# EasyEDA Pro project 内机V10_1.epro, schematic 内机底板_1, sheets 1 to 3 of 6

## Sheets
1 BLOCK: Board Name: 内机V10_1; Create Date: 2025-12-01
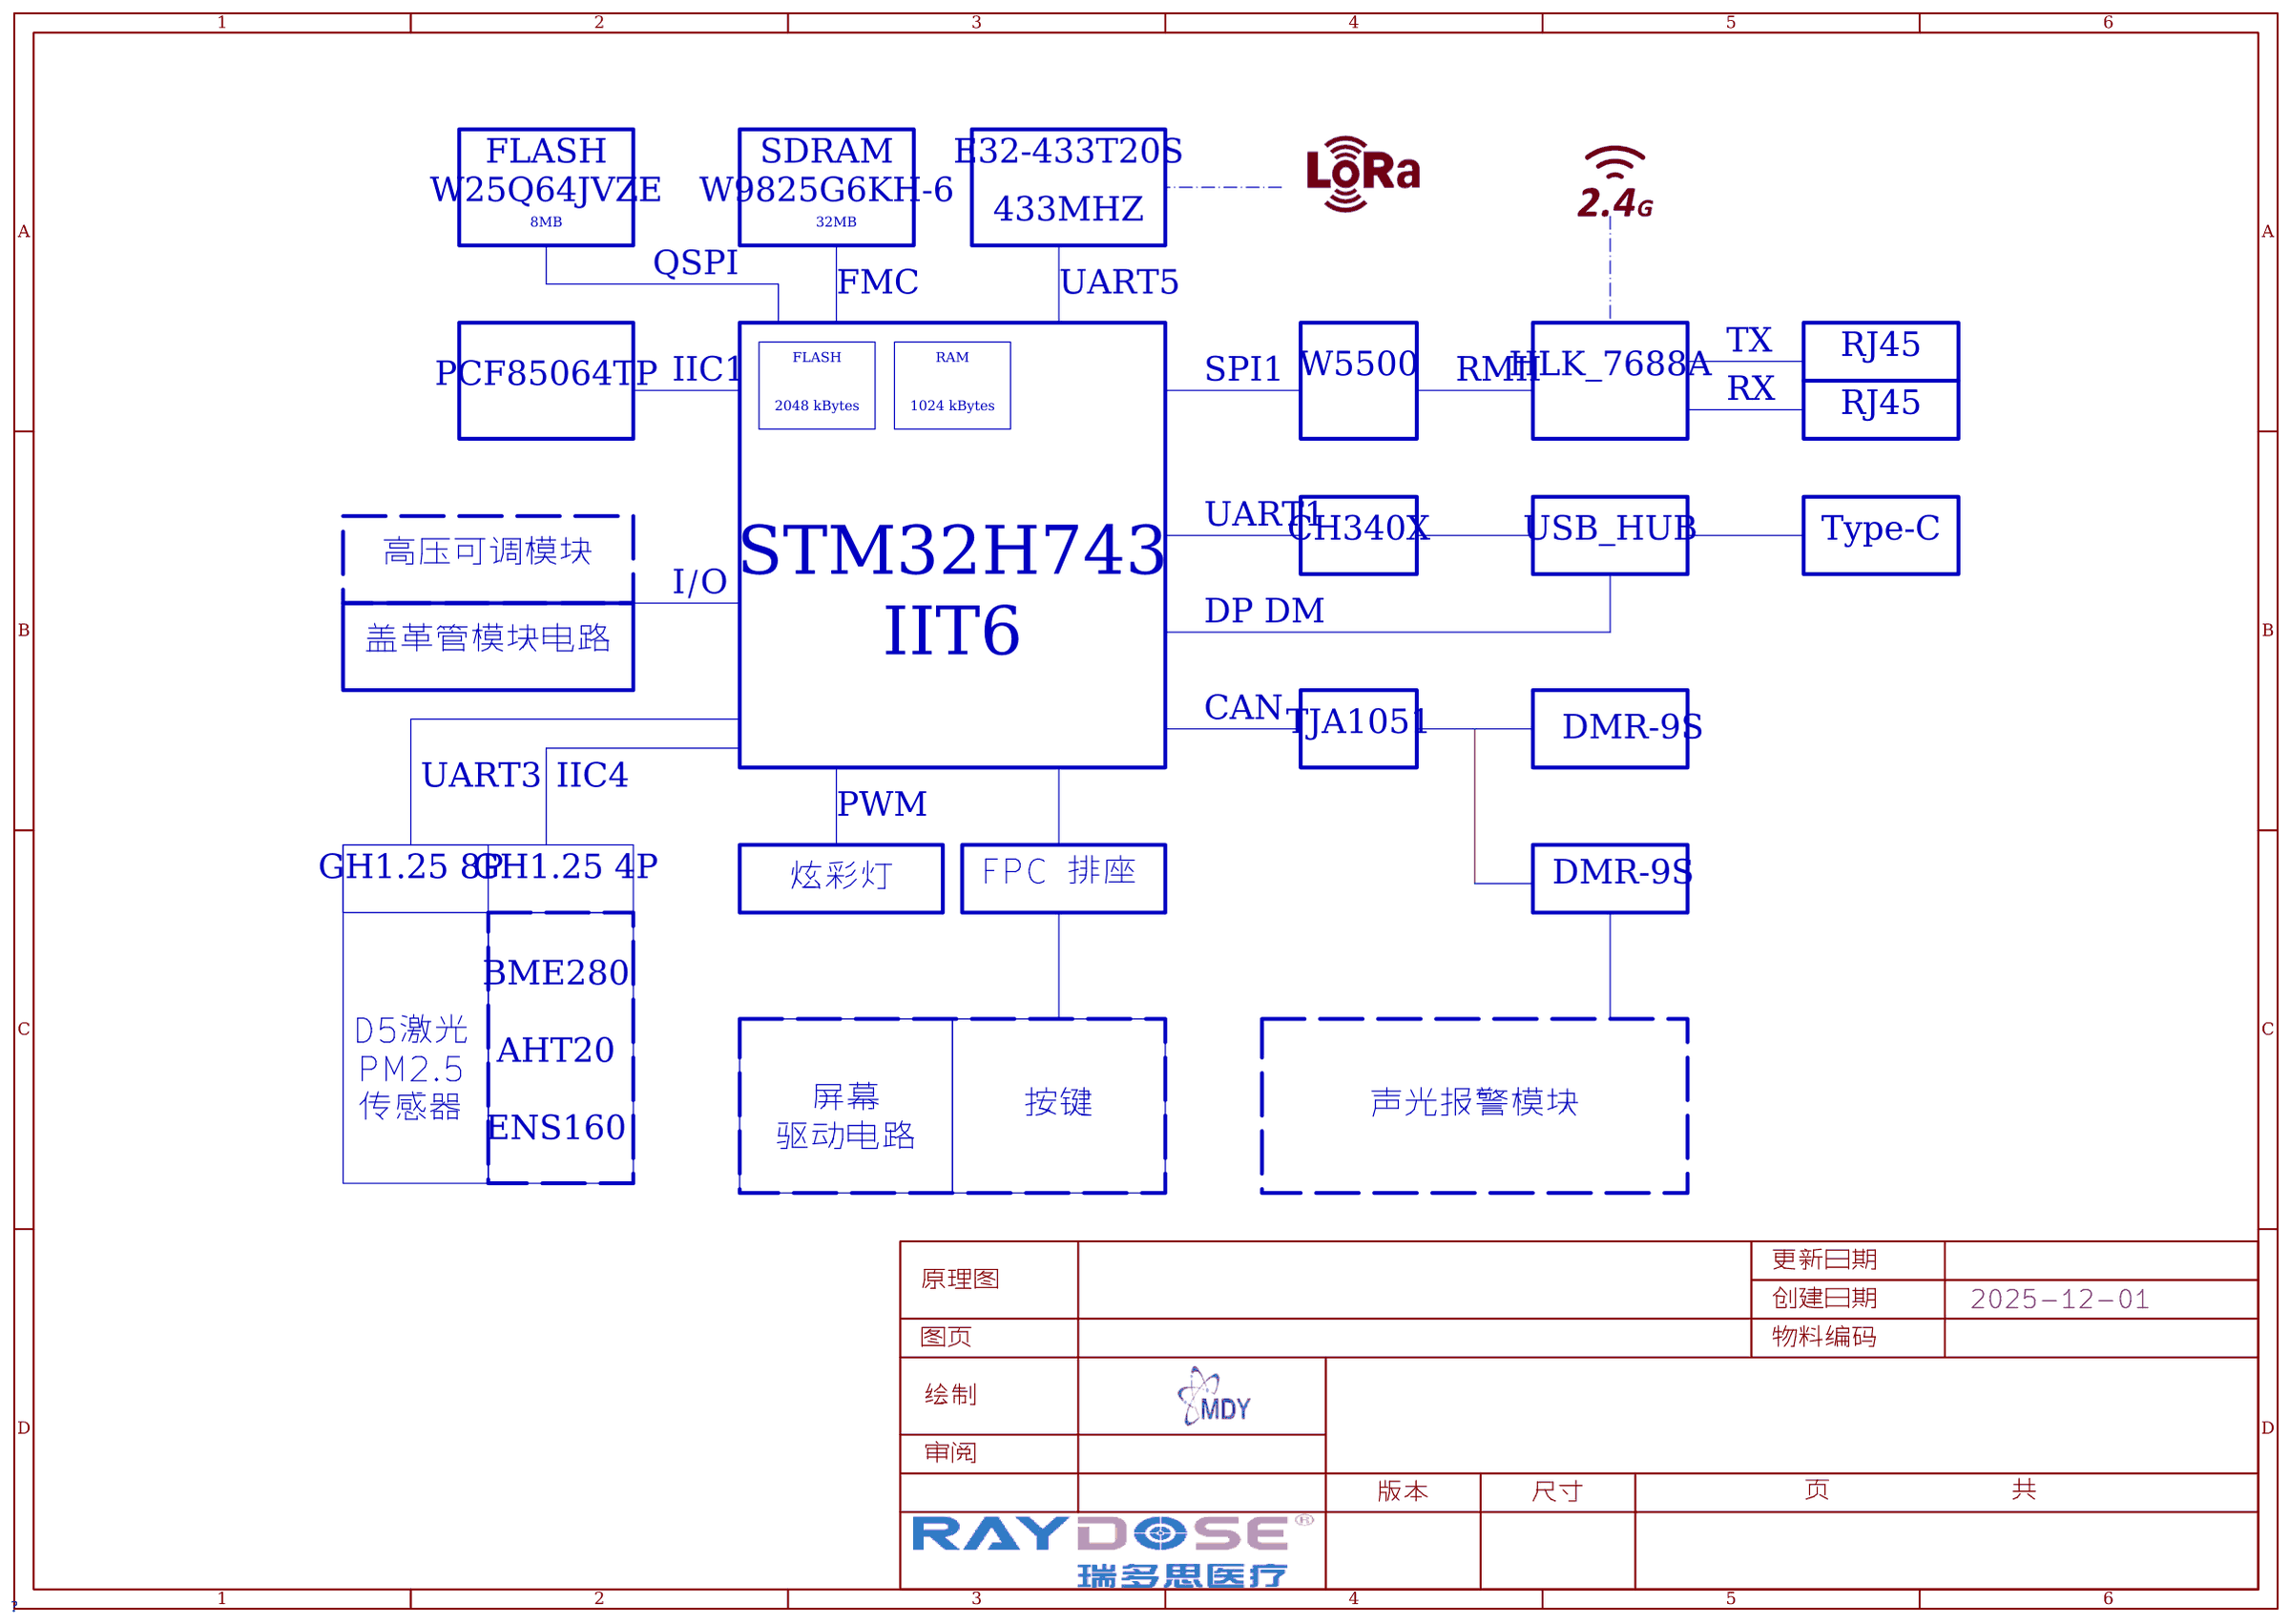
[diagram p0: BLOCK]
2 POWER: Page Size: A4
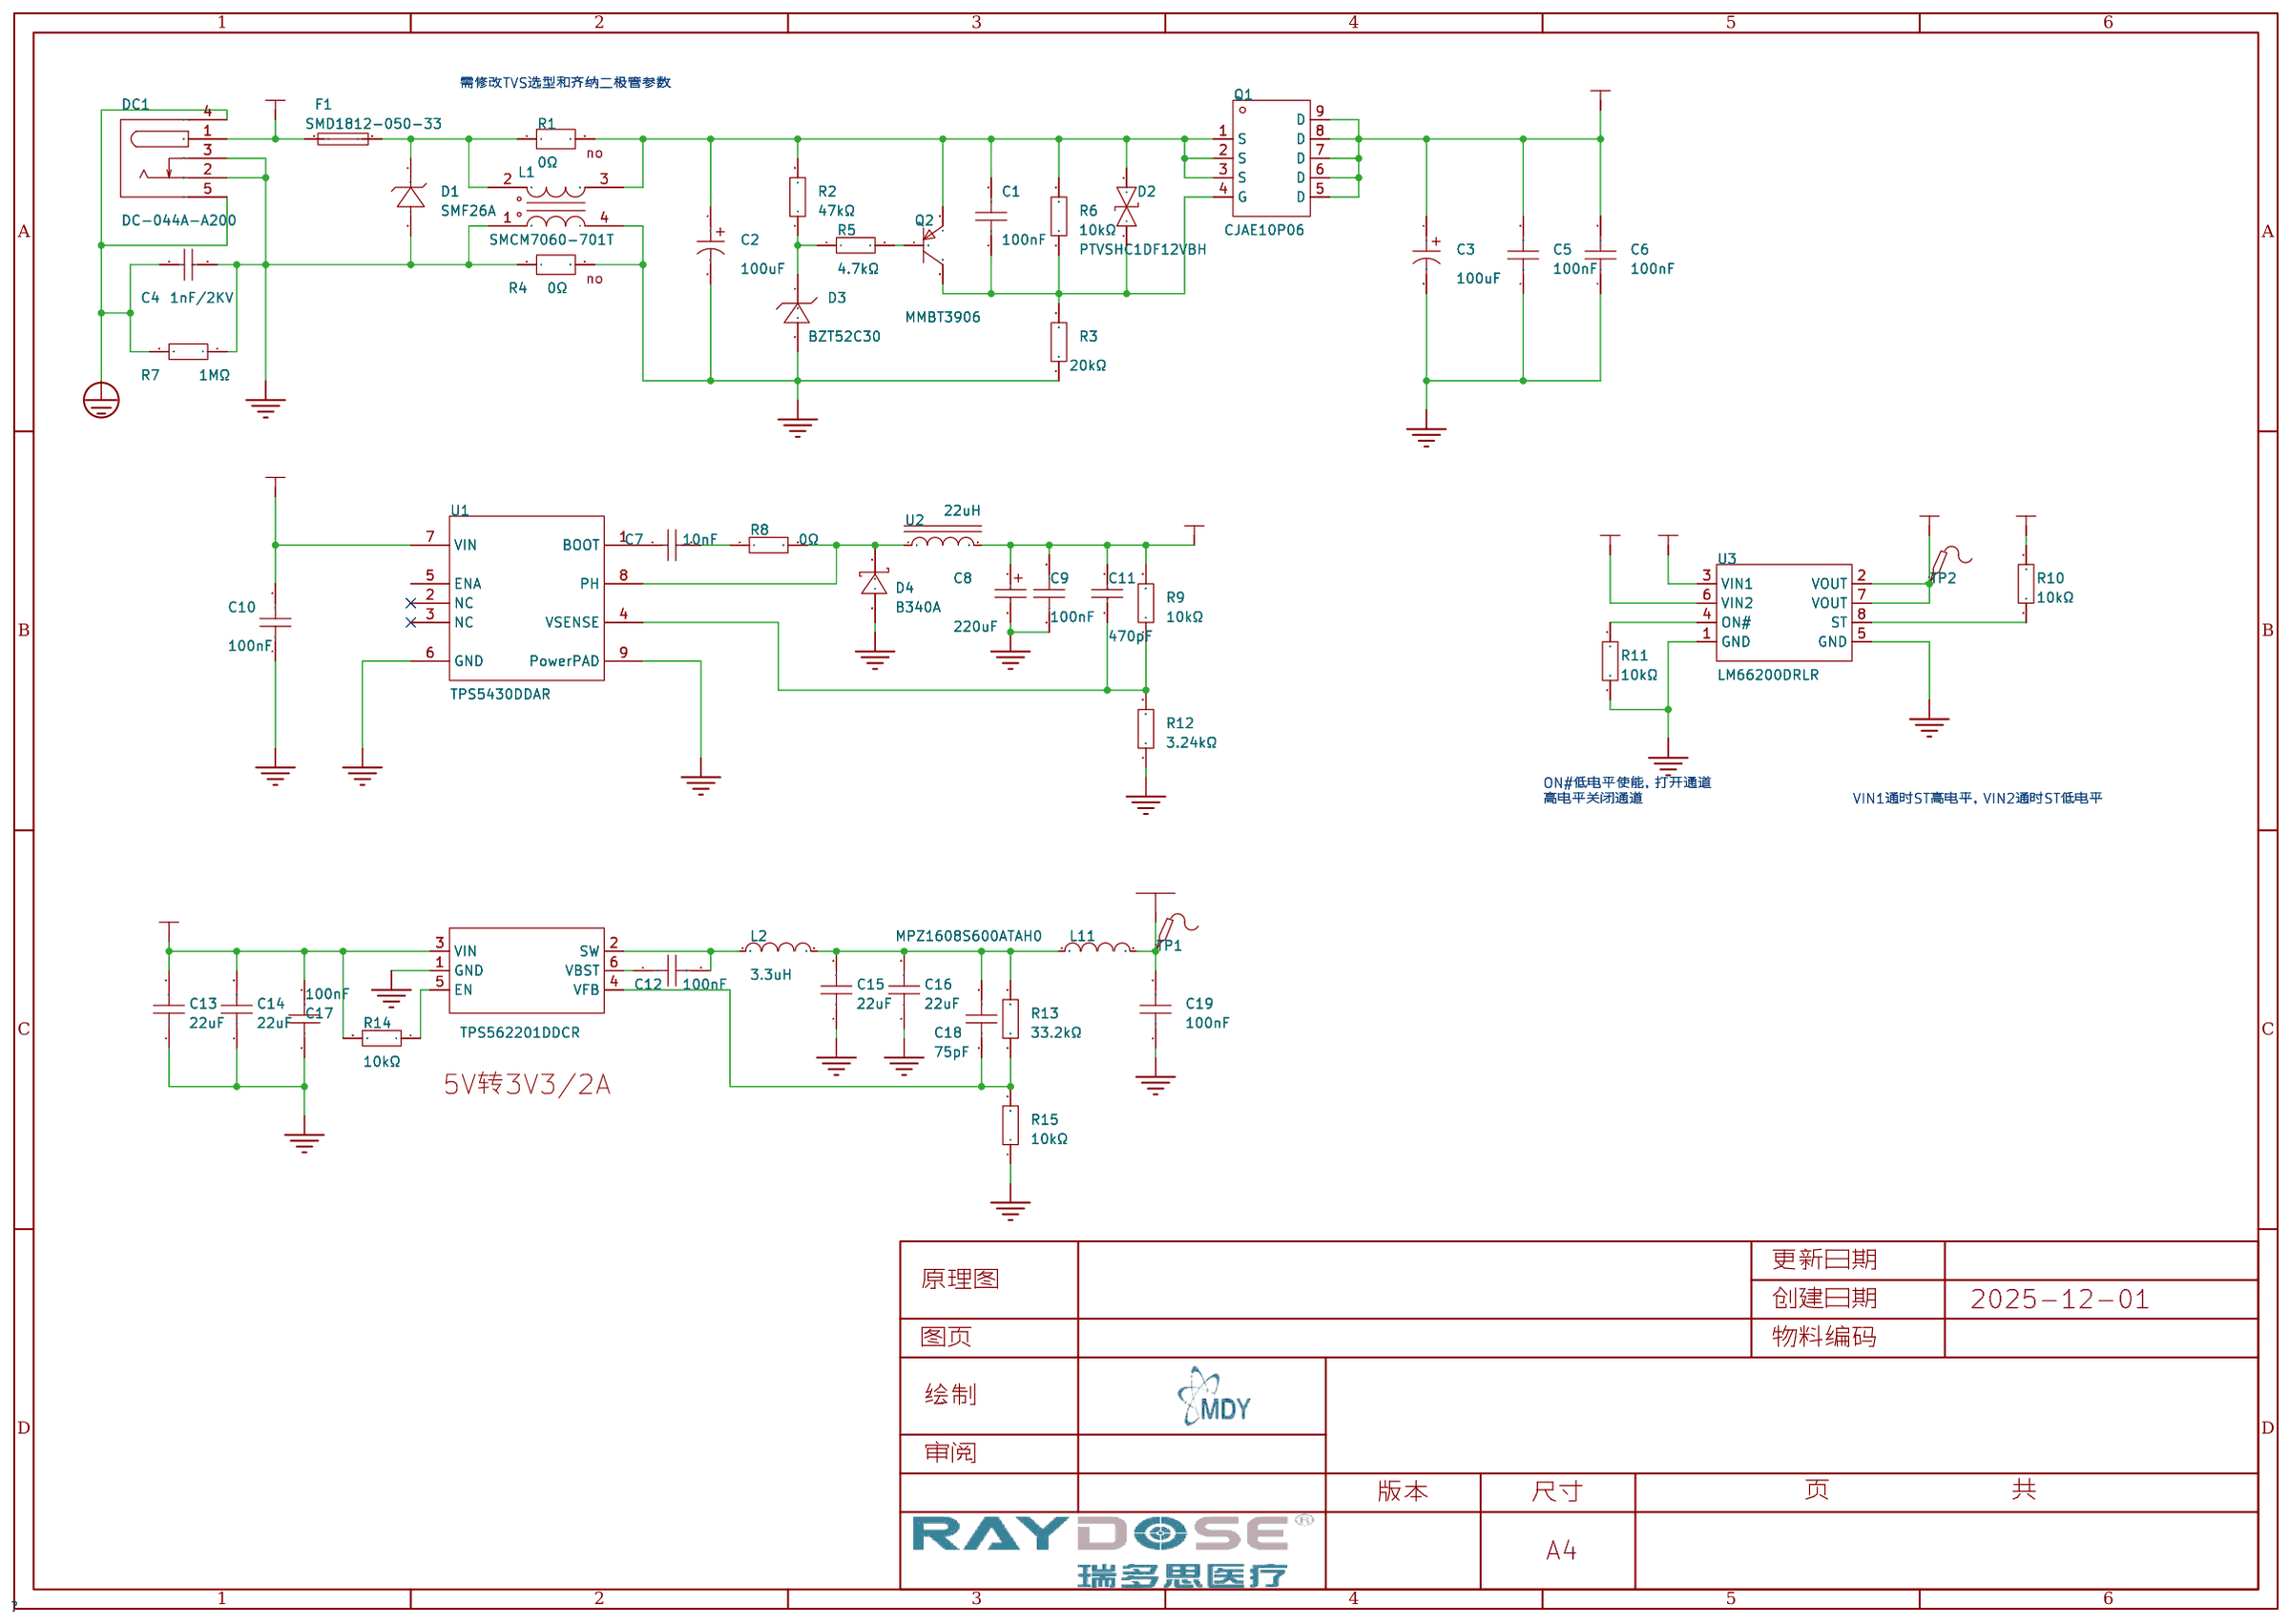
[diagram p1: POWER]
3 MAIN
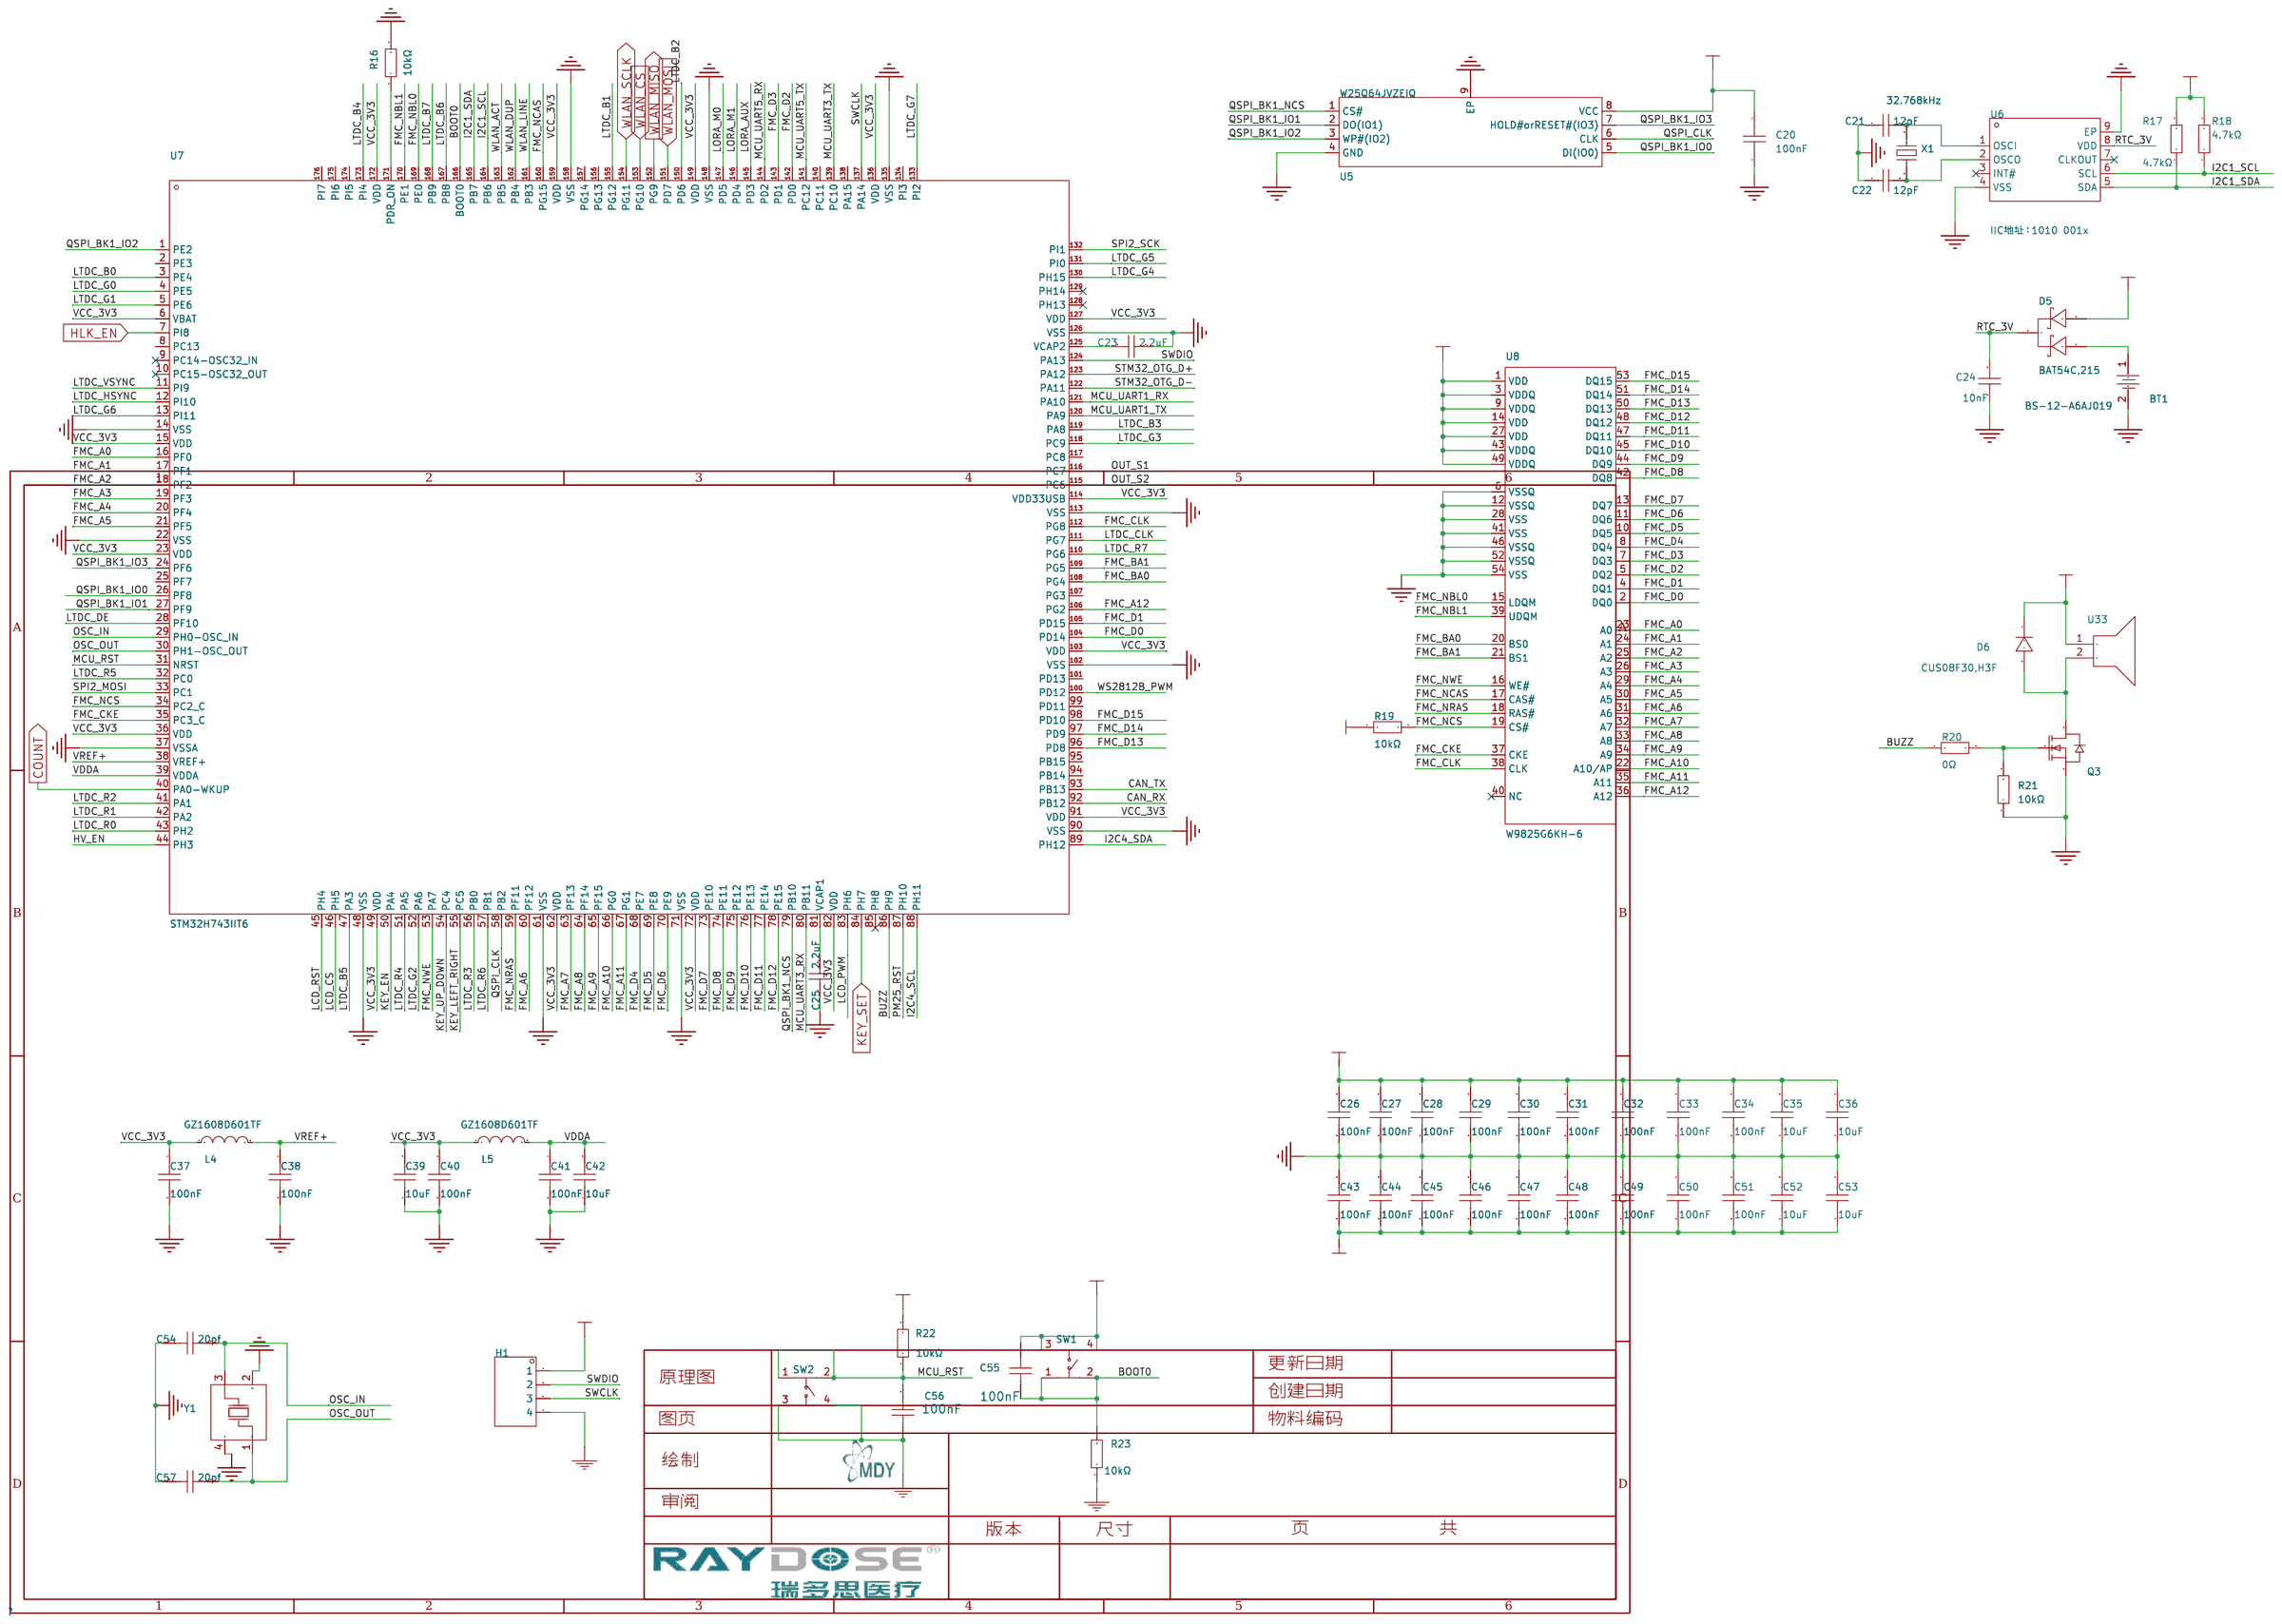
[diagram p2: MAIN]

## Parts
sheet MAIN
BT1  BS-12-A6AJ019  [BAT-TH_BS-12-A6AJ019]
C20  100nF  [C0603]
C21  12pF  [C0603]
C22  12pF  [C0603]
C23  2.2uF  [C0603]
C24  10nF  [C0603]
C25  2.2uF  [C0603]
C26  100nF  [C0603]
C27  100nF  [C0603]
C28  100nF  [C0603]
C29  100nF  [C0603]
C30  100nF  [C0603]
C31  100nF  [C0603]
C32  100nF  [C0603]
C33  100nF  [C0603]
C34  100nF  [C0603]
C35  10uF  [C0603]
C36  10uF  [C0603]
C37  100nF  [C0603]
C38  100nF  [C0603]
C39  10uF  [C0603]
C40  100nF  [C0603]
C41  100nF  [C0603]
C42  10uF  [C0603]
C43  100nF  [C0603]
C44  100nF  [C0603]
C45  100nF  [C0603]
C46  100nF  [C0603]
C47  100nF  [C0603]
C48  100nF  [C0603]
C49  100nF  [C0603]
C50  100nF  [C0603]
C51  100nF  [C0603]
C52  10uF  [C0603]
C53  10uF  [C0603]
C54  20pf  [C0603]
C55  100nF  [C0603]
C56  100nF  [C0603]
C57  20pf  [C0603]
D5  BAT54C,215  [SOT-23-3_L2.9-W1.6-P1.90-LS2.8-BR]
D6  CUS08F30,H3F  [SOD-323F_L2.0-W1.6-LS2.5-RD]
H1  -  [HDR-TH_4P-P2.54-V-M]
L4  GZ1608D601TF  [L0603]
L5  GZ1608D601TF  [L0603]
Q3  AO3400A  [SOT-23-3_L2.9-W1.3-P1.90-LS2.4-BR]
R16  10kΩ  [R0603]
R17  4.7kΩ  [R0603]
R18  4.7kΩ  [R0603]
R19  10kΩ  [R0603]
R20  0Ω  [R0603]
R21  10kΩ  [R0603]
R22  10kΩ  [R0603]
R23  10kΩ  [R0603]
SW1  -  [KEY-SMD_4P-L3.3-W3.3-P2.20-LS3.9]
SW2  -  [KEY-SMD_4P-L3.3-W3.3-P2.20-LS3.9]
U5  W25Q64JVZEIQ  [WSON-8_L8.0-W6.10-P1.27-BL-EP]
U6  400kHz  [VSON-8_L2.0-W3.0-P0.50-BL-EP]
U7  STM32H743IIT6  [LQFP-176_L24.0-W24.0-P0.50-LS26.0-BL]
U8  W9825G6KH-6  [TSOP-54_L22.2-W10.2-P0.80-LS11.8-BL]
U33  4kHz  [BUZ-SMD_L12.0-W12.0]
X1  32.768kHz  [OSC-SMD_L3.2-W1.5]
Y1  25MHz  [CRYSTAL-SMD_4P-L3.2-W2.5-BL]
sheet POWER
C1  100nF  [C0603]
C2  100uF  [CAP-SMD_BD6.3-L6.5-W6.5-LS7.2-FD]
C3  100uF  [CAP-SMD_BD6.3-L6.5-W6.5-LS7.2-FD]
C4  1nF/2KV  [C1206]
C5  100nF  [C0805]
C6  100nF  [C0805]
C7  10nF  [C0603]
C8  220uF  [CASE-D_7343]
C9  100nF  [C0805]
C10  100nF  [C0805]
C11  470pF  [C0603]  (no BOM)
C12  100nF  [C0603]
C13  22uF  [C0805]
C14  22uF  [C0805]
C15  22uF  [C0805]
C16  22uF  [C0805]
C17  100nF  [C0603]
C18  75pF  [C0603]
C19  100nF  [C0603]
D1  SMF26A  [SOD-123_L2.6-W1.8-LS3.7-RD]
D2  PTVSHC1DF12VBH  [SOD-123FL_L2.8-W1.8-LS3.7-BI]
D3  BZT52C30  [SOD-123_L2.8-W1.8-LS3.7-RD]
D4  B340A  [SMA_L4.3-W2.6-LS5.1-RD]
DC1  DC-044A-A200  [DC-IN-TH_DC-044A-20A]
F1  SMD1812-050-33  [F1812]
L1  SMCM7060-701T  [FILTER-SMD_4P-L7.0-W6.0-TL_SMCM7060]
L2  3.3uH  [IND-SMD_L4.4-W4.2-A]
L11  MPZ1608S600ATAH0  [L0603]
Q1  CJAE10P06  [DFN-8_L3.0-W3.0-P0.65-BL_G48N03D3]
Q2  MMBT3906  [SOT-23-3_L2.9-W1.3-P1.90-LS2.4-BR]
R1  0Ω  [R1206]  (no BOM)
R2  47kΩ  [R0603]
R3  20kΩ  [R0603]
R4  0Ω  [R1206]  (no BOM)
R5  4.7kΩ  [R0603]
R6  10kΩ  [R0603]
R7  1MΩ  [R1206]
R8  0Ω  [R0603]
R9  10kΩ  [R0603]
R10  10kΩ  [R0603]
R11  10kΩ  [R0603]
R12  3.24kΩ  [R0603]
R13  33.2kΩ  [R0603]
R14  10kΩ  [R0603]
R15  10kΩ  [R0603]
TP1  -  [Test-Point-1mm]
TP2  -  [Test-Point-1mm]
U1  TPS5430DDAR  [ESOP-8_L4.9-W3.9-P1.27-LS6.0-TL-EP]
U2  22uH  [IND-SMD_L6.8-W6.8_FCH0650]
U3  LM66200DRLR  [SOT-583-8_L2.1-W1.2-P0.50-LS1.6-BL]
U4  TPS562201DDCR  [SOT-23-6_L2.9-W1.6-P0.95-LS2.8-BR]

## Library data of the parts
BT1 = BS-12-A6AJ019: CR1220 DIP插脚 抗震 电池连接器 纽扣电池座; LCSC Part Name: BS-1220-1 Ni DIP PA46; Supplier Part: C48687362; Manufacturer: MYOUNG(美阳); Supplier Footprint: 插件; JLCPCB Part Class: 扩展库; Datasheet: https://atta.szlcsc.com/upload/public/pdf/source/20250506/0A604B3CA9556D2BEF3B46F2242FC990.pdf; Supplier: LCSC
C17 C20 C26-C34 C37 C38 C40 C41 C43-C51 = CC0603KRX7R9BB104: 容值:100nF;精度:±10%;额定电压:50V;材质(温度系数):X7R;; LCSC Part Name: 100nF ±10% 50V; Supplier Part: C14663; Manufacturer: YAGEO(国巨); Supplier Footprint: 0603; JLCPCB Part Class: Basic Part; Datasheet: https://atta.szlcsc.com/upload/public/pdf/source/20180910/C282072_33301C7F631E79921B82A8DAC6BCC5B3.pdf; Supplier: LCSC; Tolerance: ±10%; Voltage Rated: 50V; Temperature Coefficient: X7R
C21 C22 = CL10C120JB8NNNC: 容值:12pF;精度:±5%;额定电压:50V;材质(温度系数):C0G;; LCSC Part Name: 12pF ±5% 50V; Supplier Part: C38523; Manufacturer: SAMSUNG(三星); Supplier Footprint: 0603; JLCPCB Part Class: 基础库; Datasheet: https://atta.szlcsc.com/upload/public/pdf/source/20160218/1457707763339.pdf; Supplier: LCSC; Tolerance: ±5%; Voltage Rated: 50V; Temperature Coefficient: C0G
C23 C25 = CL10A225KO8NNNC: 容值:2.2uF;精度:±10%;额定电压:16V;温度系数:X5R;; LCSC Part Name: 2.2uF ±10% 16V; Supplier Part: C23630; Manufacturer: SAMSUNG(三星); Supplier Footprint: 0603; JLCPCB Part Class: 基础库; Datasheet: https://item.szlcsc.com/datasheet/CL10A225KO8NNNC/24366.html; Supplier: LCSC; Tolerance: ±10%; Voltage Rating: 16V; Temperature Coefficient: X5R
C7 C24 = 0603B103K500NT: 容值:10nF;精度:±10%;额定电压:50V;材质(温度系数):X7R;; LCSC Part Name: 10nF ±10% 50V; Supplier Part: C57112; Manufacturer: FH(风华); Supplier Footprint: 0603; JLCPCB Part Class: Basic Part; Datasheet: https://atta.szlcsc.com/upload/public/pdf/source/20200305/C486355_26A10D38EF8C2A5C37091D0039909270.pdf; Supplier: LCSC; Tolerance: ±10%; Voltage Rated: 50V; Temperature Coefficient: X7R
C35 C36 C39 C42 C52 C53 = CL10A106MA8NRNC: 容值:10uF;精度:±20%;额定电压:25V;材质(温度系数):X5R;; LCSC Part Name: 10uF ±20% 25V; Supplier Part: C96446; Manufacturer: SAMSUNG(三星); Supplier Footprint: 0603; JLCPCB Part Class: 基础库; Datasheet: https://atta.szlcsc.com/upload/public/pdf/source/20160218/1457707763339.pdf; Supplier: LCSC; Tolerance: ±20%; Voltage Rated: 25V; Temperature Coefficient: X5R
C54 C57 = 20pf
C55 C56 = CC0603KRX7R9BB104: 容值:100nF;精度:±10%;额定电压:50V;温度系数:X7R;; LCSC Part Name: 100nF ±10% 50V; Supplier Part: C14663; Manufacturer: YAGEO(国巨); Supplier Footprint: 0603; JLCPCB Part Class: 基础库; Datasheet: https://atta.szlcsc.com/upload/public/pdf/source/20180910/C282072_33301C7F631E79921B82A8DAC6BCC5B3.pdf; Supplier: LCSC; Tolerance: ±10%; Voltage Rated: 50V; Temperature Coefficient: X7R; Check: true; Voltage Rating: 50V
D5 = BAT54C,215: 二极管配置:1对共阴极;正向压降(Vf):800mV@100mA;直流反向耐压(Vr):30V;整流电流:200mA;; LCSC Part Name: 电压:30V 电流:200mA; Supplier Part: C37704; Manufacturer: Nexperia(安世); Supplier Footprint: SOT-23; JLCPCB Part Class: 扩展库; Datasheet: https://item.szlcsc.com/datasheet/BAT54C%252C215/38684.html; Supplier: LCSC; Diode Configuration: 1对共阴极; Voltage - Forward(Vf@If): 800mV@100mA; Voltage - DC Reverse(Vr): 30V; Current - Rectified: 200mA; Reverse Leakage Current (Ir): 2uA@25V; Non-Repetitive Peak Forward Surge Current: 600mA
D6 = CUS08F30,H3F: 正向压降(Vf):220mV@10mA;直流反向耐压(Vr):30V;整流电流:800mA;; LCSC Part Name: 电压:30V 电流:800mA; Supplier Part: C150183; Manufacturer: TOSHIBA(东芝); Supplier Footprint: SC-76(SOD-323); JLCPCB Part Class: Extended Part; Datasheet: https://atta.szlcsc.com/upload/public/pdf/source/20180126/C150183_15169561730551309331.pdf; Supplier: LCSC; Forward Voltage (Vf@If): 220mV@10mA; Reverse Voltage (Vr): 30V; Rectified Current: 800mA; Reverse Leakage Current (Ir): 50uA@30V; Average Rectified Current (Io): 800mA
H1 = B-2100S04P-A110: 间距:2.54mm;总PIN位数:4;排数:1;插针结构:1x4P;行距:-;安装类型:直插;圆针/方针:-;额定电流:-;额定电压:-;配合针长度:6mm;塑高:2.54mm;端接针长度:3mm;触头材质:黄铜;触头镀层:-;工作温度范围:-40~+105;颜色:黑色;; LCSC Part Name: 2.54mm 1x4P; Supplier Part: C124378; Manufacturer: Ckmtw(灿科盟); Supplier Footprint: 插件,P=2.54mm; JLCPCB Part Class: Extended Part; Datasheet: https://atta.szlcsc.com/upload/public/pdf/source/20170821/C124378_1503303307508901532.pdf; Supplier: LCSC; Pitch: 2.54mm; Number of Pins: 4; Number of Rows: 1; Pin Structure: 1x4P; Mounting Type: 直插; Length of Mating Pin: 6mm; Insulation Height: 2.54mm; Length of End Connection Pin: 3mm; Contact Material: 黄铜; Operating Temperature Range: -40~+105; Color: 黑色
L4 L5 = GZ1608D601TF: 阻抗 @ 频率:600Ω@100MHz;误差:±25%;直流电阻(DCR):450mΩ;; LCSC Part Name: 单路 0603磁珠 阻抗600Ω@100MHz; Supplier Part: C1002; Manufacturer: Sunlord(顺络); Supplier Footprint: 0603; JLCPCB Part Class: 基础库; Datasheet: https://atta.szlcsc.com/upload/public/pdf/source/20241120/893429B990C3BA07384E734821D2F218.pdf; Supplier: LCSC; Impedance @ Frequency: 600Ω@100MHz; Tolerance: ±25%; DC Resistance: 450mΩ; Current Rating: 200mA; Circuits: 1
Q3 = AO3400A: 类型:N沟道;漏源电压(Vdss):30V;连续漏极电流(Id):5.2A;功率(Pd):1W;导通电阻(RDS(on)@Vgs,Id):35m@10V,5A;阈值电压(Vgs(th)@Id):1.5V@250A;; Supplier Part: C700953; Manufacturer: HUASHUO(华朔); Supplier Footprint: SOT-23; JLCPCB Part Class: Extended Part; Datasheet: https://atta.szlcsc.com/upload/public/pdf/source/20200713/C700953_2C399A25E2B0CA38CA8BE1B404780CC1.pdf; Supplier: LCSC; Drain Source On Resistance (RDS(on)@Vgs,Id): 35m@10V,5A; Gate Threshold Voltage (Vgs(th)@Id): 1.5V@250A
R16 R22 R23 = 0603WAF1002T5E: 电阻类型:厚膜电阻;阻值:10kΩ;精度:±1%;功率:100mW;最大工作电压:75V;温度系数:±100ppm/℃;; LCSC Part Name: 厚膜电阻 10kΩ ±1% 100mW; Supplier Part: C25804; Manufacturer: UNI-ROYAL(厚声); Supplier Footprint: 0603; JLCPCB Part Class: Basic Part; Datasheet: https://atta.szlcsc.com/upload/public/pdf/source/20200306/C422600_1E6D84923E4A46A82E41ADD87F860B5C.pdf; Supplier: LCSC; Type: 厚膜电阻; Tolerance: ±1%; Power(Watts): 100mW; Overload Voltage (Max): 75V; Temperature Coefficient: ±100ppm/℃; Operating Temperature Range: -55℃~+155℃; Check: true
R5 R17 R18 = 0603WAF4701T5E: 电阻类型:厚膜电阻;阻值:4.7kΩ;精度:±1%;功率:100mW;最大工作电压:75V;温度系数:±100ppm/℃;; LCSC Part Name: 4.7kΩ ±1% 100mW 厚膜电阻; Supplier Part: C23162; Manufacturer: UNI-ROYAL(厚声); Supplier Footprint: 0603; JLCPCB Part Class: Basic Part; Datasheet: https://atta.szlcsc.com/upload/public/pdf/source/20200306/C422600_1E6D84923E4A46A82E41ADD87F860B5C.pdf; Supplier: LCSC; Type: 厚膜电阻; Tolerance: ±1%; Power(Watts): 100mW; Overload Voltage (Max): 75V; Temperature Coefficient: ±100ppm/℃; Operating Temperature Range: -55℃~+155℃
R6 R9-R11 R14 R15 R19 R21 = 0603WAF1002T5E: 电阻类型:厚膜电阻;阻值:10kΩ;精度:±1%;功率:100mW;最大工作电压:75V;温度系数:±100ppm/℃;; LCSC Part Name: 厚膜电阻 10kΩ ±1% 100mW; Supplier Part: C25804; Manufacturer: UNI-ROYAL(厚声); Supplier Footprint: 0603; JLCPCB Part Class: Basic Part; Datasheet: https://atta.szlcsc.com/upload/public/pdf/source/20200306/C422600_1E6D84923E4A46A82E41ADD87F860B5C.pdf; Supplier: LCSC; Type: 厚膜电阻; Tolerance: ±1%; Power(Watts): 100mW; Overload Voltage (Max): 75V; Temperature Coefficient: ±100ppm/℃; Operating Temperature Range: -55℃~+155℃
R8 R20 = 0603WAF0000T5E: 电阻类型:厚膜电阻;阻值:0Ω;精度:±1%;功率:100mW;最大工作电压:75V;; LCSC Part Name: 0Ω ±1% 100mW 厚膜电阻; Supplier Part: C21189; Manufacturer: UNI-ROYAL(厚声); Supplier Footprint: 0603; JLCPCB Part Class: 基础库; Datasheet: https://atta.szlcsc.com/upload/public/pdf/source/20200306/C422600_1E6D84923E4A46A82E41ADD87F860B5C.pdf; Supplier: LCSC; Type: 厚膜电阻; Tolerance: ±1%; Power(Watts): 100mW; Overload Voltage (Max): 75V; Operating Temperature Range: -55℃~+155℃
SW1 SW2 = TS3320A: 触点电流:50mA;额定电压(DC):12V;绝缘电阻:100MΩ;电路结构:单刀单掷;安装方式:立贴;按钮形状:圆形按钮;按钮/盖帽颜色:黑色;机械寿命:50000;工作温度:-25~+70;引脚样式:SMD接片;开关长度:3.3mm;开关宽度:3.3mm;开关高度:2mm;带支架:否;; LCSC Part Name: 轻触开关 3.3*3.3*2.0mm黑色硅胶按键 250力度; Supplier Part: C2681475; Manufacturer: SHOU HAN(首韩); Supplier Footprint: SMD; JLCPCB Part Class: Extended Part; Datasheet: https://atta.szlcsc.com/upload/public/pdf/source/20210224/C2681475_49BAFF82C70BBEACA3FDEB8209DED2EE.pdf; Supplier: LCSC; Contact Current: 50mA; Voltage Rating (DC): 12V; Insulation Resistance: 100MΩ; Circuit: 单刀单掷; Mounting Style: 立贴; Actuator Style: 圆形按钮; Actuator/Cap Color: 黑色; Mechanical Life: 50000; Operating Temperature: -25~+70; Pin Style: SMD接片; Switch Length: 3.3mm; Switch Width: 3.3mm; Switch Height: 2mm; Strike Gundam: 否
U5 = W25Q64JVZEIQ_C571262: 接口类型:SPI;存储容量:64Mbit;时钟频率(fc):133MHz;; Supplier Part: C571262; Manufacturer: Winbond(华邦); Supplier Footprint: WSON-8-EP(6x8); JLCPCB Part Class: 扩展库; Datasheet: https://atta.szlcsc.com/upload/public/pdf/source/20200623/C571262_E4E48B163420CB751DCE7A46E02C1527.pdf; Supplier: LCSC; Interface: SPI; Memory Size: 64Mbit; Clock Frequency: 133MHz; Voltage - Supply: 2.7V~3.6V; Program / Erase Cycles: 100000次; Page Programming Time (Tpp): 400us; Block Erase Time(tBE): 120ms@(32KB); Data Retention - TDR (Year): 20年; Operating Temperature: -40℃~+85℃
U6 = PCF85063TP/1Z: Supplier Part: C126170; Manufacturer: NXP(恩智浦); Supplier Footprint: VSON-8-EP(2x3); JLCPCB Part Class: 扩展库; Datasheet: https://atta.szlcsc.com/upload/public/pdf/source/20191129/C126170_981191297460F7359CEAC0EA84BD6628.pdf; Supplier: LCSC; Supply Voltage: 900mV~5.5V; Input Low Voltage: 0V~1.65V; Intput High Voltage: 0.63V~5.5V; Output Low Voltage: 0V~1.1V; Output High Voltage: 0.72V~5.5V; Operating Temperatue: -40℃~+85℃
U7 = STM32H743IIT6: CPU内核:-;程序存储容量:2MB;RAM总容量:1MB;GPIO端口数量:140;工作电压范围:1.62V~3.6V;CPU最大主频:480MHz;程序存储器类型:FLASH;; LCSC Part Name: 带DSP和DP-FPU的高性能ARM Cortex-M7 MCU，具有2 MB Flash、1 MB RAM、480 MHz CPU、ART加速器、一级缓存、外部存储器接口和大量外设; Supplier Part: C89597; Manufacturer: ST(意法半导体); Supplier Footprint: LQFP-176(24x24); JLCPCB Part Class: 扩展库; Datasheet: https://atta.szlcsc.com/upload/public/pdf/source/20240801/032C575B9AAB8514934CF1EBEB30E849.pdf; Supplier: LCSC; Program Storage Size: 2MB; RAM Size: 1MB; GPIO Ports Number: 140; Operating Voltage Range: 1.62V~3.6V; CPU Maximum Speed: 480MHz; Program Memory Type: FLASH; Operating Temperature Range: -40℃~+85℃; ADC (Bit): 16bit; DAC (Bit): 12bit; Universal Serial Bus: 有; Peripheral/Function: DMA；LCD/LED驱动；PWM; Watchdog: 有; Infrared Data Association: 有; Low-Voltage Detect: 有; LCD Module: 有; Secure Digital Input and Output: 有; Direct Memory Access: 有; Internal Oscillator: 有
U8 = W9825G6KH-6: Supplier Part: C62246; Manufacturer: WINBOND(华邦); Supplier Footprint: TSOP-54-10.2mm; JLCPCB Part Class: 扩展库; Datasheet: https://atta.szlcsc.com/upload/public/pdf/source/20170316/1489630415513.pdf; Supplier: LCSC
U33 = HYG-1203A: 额定电压:5V;频率:4kHz;声压(SPL):85dB;; LCSC Part Name: 贴片无源蜂鸣器; Supplier Part: C7544817; Manufacturer: HYDZ(华宇); Supplier Footprint: SMD,12x12x3MM; JLCPCB Part Class: Extended Part; Datasheet: https://item.szlcsc.com/datasheet/HYG-1203A/8653391.html; Supplier: LCSC; Voltage Rating: 5V; Voltage - Supply: 1V~20V; Current Consumption: 1mA; Sound Pressure Level(SPL): 85dB; Length: 12mm; Width: 12mm; Height: 3mm; Operating Temperature: -20℃~+70℃; Mounting Type: 贴片
X1 = X321532768KGD2SI: 晶振类型:贴片晶振;频率:32.768kHz;常温频差:±20ppm;负载电容:12.5pF;频率稳定度:±30ppm;; LCSC Part Name: YST310S 32.768KHZ 2P 3215 12.5PF ±20PPM -40~85℃; Supplier Part: C620155; Manufacturer: YXC(扬兴晶振); Supplier Footprint: SMD3215-2P; JLCPCB Part Class: 扩展库; Datasheet: https://item.szlcsc.com/datasheet/X321532768KGD2SI/649983.html; Supplier: LCSC; Type: 贴片晶振; Normal temperature Frequency Tolerance: ±20ppm; Load Capacitance: 12.5pF; Frequency Stability: ±30ppm; Operating Temperature: -40℃~+85℃
Y1 = X322525MOB4SI: 晶振类型:贴片晶振;频率:25MHz;常温频差:±10ppm;负载电容:12pF;频率稳定度:±20ppm;; LCSC Part Name: YSX321SL 25MHZ 4P 3225 12PF ±10PPM -40~85℃ (±20PPM); Supplier Part: C9006; Manufacturer: YXC(扬兴晶振); Supplier Footprint: SMD3225-4P; JLCPCB Part Class: Basic Part; Datasheet: https://atta.szlcsc.com/upload/public/pdf/source/20240329/19D5F850207469550BEB00D7DFEDBC7A.pdf; Supplier: LCSC; Crystal Type: 贴片晶振; Normal temperature Frequency Tolerance: ±10ppm; Load Capacitor: 12pF; Frequency Stability(Full temperature range): ±20ppm; Operating Temperature: -40℃~+85℃; External load capacitor: 12pF; Type: 贴片晶振; Load Capacitance: 12pF; Frequency Stability: ±20ppm
C1 C12 C19 = CC0603KRX7R9BB104: 容值:100nF;精度:±10%;额定电压:50V;材质(温度系数):X7R;; LCSC Part Name: 100nF ±10% 50V; Supplier Part: C14663; Manufacturer: YAGEO(国巨); Supplier Footprint: 0603; JLCPCB Part Class: 基础库; Datasheet: https://atta.szlcsc.com/upload/public/pdf/source/20180910/C282072_33301C7F631E79921B82A8DAC6BCC5B3.pdf; Supplier: LCSC; Tolerance: ±10%; Voltage Rated: 50V; Temperature Coefficient: X7R
C2 C3 = KNM2100UF35V149EC0055: 容值:100uF;精度:±20%;额定电压:35V;纹波电流:1.516A@100kHz;等效串联电阻(ESR):80mΩ@100kHz;; LCSC Part Name: 100uF ±20% 35V; Supplier Part: C2982822; Manufacturer: KNSCHA(科尼盛); Supplier Footprint: SMD,D6.3xL7mm; JLCPCB Part Class: 扩展库; Datasheet: https://item.szlcsc.com/datasheet/KNM2100UF35V149EC0055/3414815.html; Supplier: LCSC; Tolerance: ±20%; Voltage Rating: 35V; Ripple Current: 1.516A@100kHz; Equivalent Series Resistance(ESR): 80mΩ@100kHz; Pin Spacing: 2.5mm; Diameter: 6.3mm; Height - Seated (Max): 7mm; Lifetime: 2000hrs@105℃; Operating Temperature: -55℃~+105℃
C4 = 1206B102K202NT: 容值:1nF;精度:±10%;额定电压:2kV;材质(温度系数):X7R;; LCSC Part Name: 1nF ±10% 2kV; Supplier Part: C9196; Manufacturer: FH(风华); Supplier Footprint: 1206; JLCPCB Part Class: 基础库; Datasheet: https://atta.szlcsc.com/upload/public/pdf/source/20200305/C486355_26A10D38EF8C2A5C37091D0039909270.pdf; Supplier: LCSC; Tolerance: ±10%; Voltage Rated: 2kV; Temperature Coefficient: X7R
C5 C6 C9 C10 = CC0805KRX7R9BB104: 容值:100nF;精度:±10%;额定电压:50V;材质(温度系数):X7R;; LCSC Part Name: 100nF ±10% 50V; Supplier Part: C49678; Manufacturer: YAGEO(国巨); Supplier Footprint: 0805; JLCPCB Part Class: 基础库; Datasheet: https://atta.szlcsc.com/upload/public/pdf/source/20180224/C181747_15194369449651363981.pdf; Supplier: LCSC; Tolerance: ±10%; Voltage Rated: 50V; Temperature Coefficient: X7R
C8 = 293D227X9010D2TE3: 容值:220uF;精度:±10%;额定电压:10V;等效串联电阻(ESR):600mΩ@100kHz;; LCSC Part Name: 220uF ±10% 10V; Supplier Part: C130380; Manufacturer: VISHAY(威世); Supplier Footprint: CASE-D-7343; JLCPCB Part Class: 扩展库; Datasheet: https://item.szlcsc.com/datasheet/293D227X9010D2TE3/141667.html; Supplier: LCSC; Tolerance: ±10%; Voltage Rating: 10V; Equivalent Series Resistance(ESR): 600mΩ@100kHz; Operating Temperature: -55℃~+125℃
C11 = 0603B471K500NT: 容值:470pF;精度:±10%;额定电压:50V;温度系数:X7R;; LCSC Part Name: 470pF ±10% 50V; Supplier Part: C1620; Manufacturer: FH(风华); Supplier Footprint: 0603; JLCPCB Part Class: 基础库; Datasheet: https://atta.szlcsc.com/upload/public/pdf/source/20200305/C486355_26A10D38EF8C2A5C37091D0039909270.pdf; Supplier: LCSC; Tolerance: ±10%; Voltage Rating: 50V; Temperature Coefficient: X7R
C13-C16 = CL21A226MAQNNNE: 容值:22uF;精度:±20%;额定电压:25V;材质(温度系数):X5R;; LCSC Part Name: 22uF ±20% 25V; Supplier Part: C45783; Manufacturer: SAMSUNG(三星); Supplier Footprint: 0805; JLCPCB Part Class: Basic Part; Datasheet: https://atta.szlcsc.com/upload/public/pdf/source/20160218/1457707763339.pdf; Supplier: LCSC; Tolerance: ±20%; Voltage Rated: 25V; Temperature Coefficient: X5R
C18 = CC0603JRNPO9BN750: 容值:75pF;精度:±5%;额定电压:50V;材质(温度系数):NP0;; LCSC Part Name: 75pF ±5% 50V; Supplier Part: C282074; Manufacturer: YAGEO(国巨); Supplier Footprint: 0603; JLCPCB Part Class: 扩展库; Datasheet: https://atta.szlcsc.com/upload/public/pdf/source/20181008/C309499_21CC21451B82C39E3D92150FD6B30293.pdf; Supplier: LCSC; Tolerance: ±5%; Voltage Rated: 50V; Temperature Coefficient: NP0
D1 = SMF26A_C41376090: 极性:单向;反向截止电压(Vrwm):26V;钳位电压:42.1V;峰值脉冲电流(Ipp):4.8A;峰值脉冲功率(Ppp):200W;击穿电压:31.9V;; LCSC Part Name: 单向TVS 26V截止 峰值浪涌电流：4.8A; Supplier Part: C41376090; Manufacturer: 宏嘉诚; Supplier Footprint: SOD-123FL; JLCPCB Part Class: 扩展库; Datasheet: https://item.szlcsc.com/datasheet/SMF26A/43144807.html; Supplier: LCSC; Polarity: 单向; Reverse Stand-Off Voltage (Vrwm): 26V; Clamping Voltage: 42.1V; Peak Pulse Current (Ipp): 4.8A; Peak Pulse Power Dissipation (Ppp): 200W; Voltage - Breakdown: 31.9V; Reverse Leakage Current (Ir): 1uA; Number of Channels: 单路; Operating Temperature: -55℃~+150℃; level of protection: IEC 61000-4-2; Type: TVS
D2 = PTVSHC1DF12VBH: 极性:双向;反向截止电压(Vrwm):12V;最大钳位电压:26V;峰值脉冲电流(Ipp)@10/1000us:160A;击穿电压:13.5V;; LCSC Part Name: 双向ESD; Supplier Part: C110748; Manufacturer: Prisemi(芯导); Supplier Footprint: SOD-123F; JLCPCB Part Class: 扩展库; Datasheet: https://atta.szlcsc.com/upload/public/pdf/source/20170502/1493709289958.pdf; Supplier: LCSC; polarity: 双向; Reverse Stand-Off Voltage (Vrwm): 12V; Maximum Clamping Voltage: 26V; Peak Pulse Current (Ipp)@10/1000us: 160A; Breakdown Voltage: 13.5V; Type: ESD
D3 = BZT52C30_C266573: 二极管配置:独立式;稳压值(标称值):30V;稳压值(范围):28V~32V;耗散功率(Pd):500mW;; Supplier Part: C266573; Manufacturer: BORN(伯恩半导体); Supplier Footprint: SOD-123; JLCPCB Part Class: 扩展库; Datasheet: https://item.szlcsc.com/datasheet/BZT52C30/256922.html; Supplier: LCSC; Diode Configuration: 独立式; Zener Voltage(Nom): 30V; Reverse Leakage Current (Ir): 100nA; Zener Voltage(Range): 28V~32V; Pd - Power Dissipation: 500mW; Impedance(Zzt): 80Ω; Impedance(Zzk): 300Ω
D4 = B340A: 二极管配置:独立式;正向压降(Vf):550mV@3A;直流反向耐压(Vr):40V;整流电流:3A;; LCSC Part Name: 电压:40V 电流:3A; Supplier Part: C64982; Manufacturer: MDD(辰达半导体); Supplier Footprint: SMA(DO-214AC); JLCPCB Part Class: 扩展库; Datasheet: https://item.szlcsc.com/datasheet/B340A/66052.html; Supplier: LCSC; Diode Configuration: 独立式; Voltage - Forward(Vf@If): 550mV@3A; Voltage - DC Reverse(Vr): 40V; Current - Rectified: 3A; Reverse Leakage Current (Ir): 500uA@40V; Operating Junction Temperature Range: -50℃~+150℃
DC1 = DC-044A-A200: 连接器类型:DC电源插座;安装方式:弯插;触点内径:2mm;触点外径:5.9mm;额定电流:3A;额定电压:30V;工作温度范围:-20℃~+70℃;; LCSC Part Name: DC电源插座 内径:2mm 外径:5.9mm; Supplier Part: C720575; Manufacturer: XUNPU(讯普); Supplier Footprint: 插件; JLCPCB Part Class: 扩展库; Datasheet: https://atta.szlcsc.com/upload/public/pdf/source/20241022/B4D2BBE0C28FB79266F1BF561E3C3247.pdf; Supplier: LCSC; Connector Type: DC电源插座; Mounting Style: 弯插; Inside Contact Diameter: 2mm; Outside Contact Diameter: 5.9mm; Current Rating (Max): 3A; Voltage Rating (Max): 30V; Operating Temperature Range: -20℃~+70℃
F1 = SMD1812-050-33: 耐压(Vmax):33V;最大电流(Imax):40A;保持电流(Ihold):500mA;跳闸电流(Itrip):1A;; Supplier Part: C46641047; Manufacturer: 宏嘉诚; Supplier Footprint: 1812; JLCPCB Part Class: 扩展库; Datasheet: https://item.szlcsc.com/datasheet/SMD1812-050-33/48798753.html; Supplier: LCSC; Voltage - Max: 33V; Current - Max: 40A; Hold Current: 500mA; Trip Current: 1A; Power Dissipation: 1W; Resistance - Initial (Ri) (Min): 150mΩ; Resistance - Post Trip (R1) (Max): 1.4Ω; Time to Trip(Max): 150ms; Operating Temperature: -40℃~+85℃
L1 = SMCM7060-701T: 通道数:2;阻抗@频率:500Ω;直流电阻(DCR):15mΩ;; LCSC Part Name: 两路 贴片共模滤波器 阻抗700Ω@100MHz; Supplier Part: C381614; Manufacturer: SXN(顺翔诺); Supplier Footprint: SMD,7x6mm; JLCPCB Part Class: 扩展库; Datasheet: https://atta.szlcsc.com/upload/public/pdf/source/20210810/7E4749E6D81F48CB84A49D0AD88B3955.pdf; Supplier: LCSC; Number of Lines: 2; Current Rating: 4A; Voltage Rating - DC: 125V; Impedance @ Frequency: 500Ω; DC Resistance(DCR): 15mΩ; Operating Temperature: -40℃~+125℃
L2 = FXL0420-3R3-M: 电感值:3.3uH;精度:±20%;额定电流:3.3A;饱和电流(Isat):4A;类型:一体成型电感;; LCSC Part Name: 3.3uH ±20% 4A; Supplier Part: C167207; Manufacturer: cjiang(长江微电); Supplier Footprint: SMD,4.2x4.4mm; JLCPCB Part Class: 扩展库; Datasheet: https://atta.szlcsc.com/upload/public/pdf/source/20240426/3189EA8206330E2108542F9E34E540E7.pdf; Supplier: LCSC; Tolerance: ±20%; Rated Current: 3.3A; Saturation Current (Isat): 4A; DC Resistance (DCR): 87mΩ; Type: 一体成型电感
L11 = MPZ1608S600ATAH0: 标称阻抗@测试频率:60Ω@100MHz;误差:±25%;直流电阻(RDC):20mΩ;; LCSC Part Name: 单路 0603磁珠 阻抗60Ω@100MHz; Supplier Part: C76816; Manufacturer: TDK; Supplier Footprint: 0603; JLCPCB Part Class: 扩展库; Datasheet: https://atta.szlcsc.com/upload/public/pdf/source/20170420/1492670791787.pdf; Supplier: LCSC; Impedance @ Frequency: 60Ω@100MHz; Tolerance: ±25%; DC Resistance: 20mΩ; Current Rating: 3.5A; Circuits: 1
Q1 = CJAE10P06: 数量:1个P沟道;漏源电压(Vdss):60V;连续漏极电流(Id):10A;导通电阻(RDS(on)):35mΩ@10V;耗散功率(Pd):3W;阈值电压(Vgs(th)):3V@250uA;; LCSC Part Name: 1个P沟道 耐压:60V 电流:10A; Supplier Part: C2943210; Manufacturer: CJ(江苏长电/长晶); Supplier Footprint: DFNWB-8L-EP(3x3); JLCPCB Part Class: 扩展库; Datasheet: https://item.szlcsc.com/datasheet/CJAE10P06/3325531.html; Supplier: LCSC; Number: 1个P沟道; Drain to Source Voltage: 60V; Current - Continuous Drain(Id): 10A; RDS(on): 35mΩ@10V; Pd - Power Dissipation: 3W; Gate Threshold Voltage (Vgs(th)): 3V@250uA; Gate Charge(Qg): 52nC@10V; Input Capacitance(Ciss): 4.5nF; Reverse Transfer Capacitance (Crss@Vds): 515pF; Operating Temperature: -55℃~+150℃; Type: P沟道; Output Capacitance(Coss): 705pF
Q2 = MMBT3906_C7420354: 晶体管类型:PNP;集电极电流(Ic):200mA;集射极击穿电压(Vceo):40V;耗散功率(Pd):200mW;直流电流增益(hFE):100@10mA,1.0V;; Supplier Part: C7420354; Manufacturer: 宏嘉诚; Supplier Footprint: SOT-23; JLCPCB Part Class: 扩展库; Datasheet: https://atta.szlcsc.com/upload/public/pdf/source/20250624/A5A9F2CFE2AD2FB95E4C4061082392AF.pdf; Supplier: LCSC; type: PNP; Current - Collector(Ic): 200mA; Collector - Emitter Voltage VCEO: 40V; Pd - Power Dissipation: 200mW; DC Current Gain: 100@10mA,1.0V; Transition frequency(fT): 300MHz; Current - Collector Cutoff: 100nA; Vce Saturation(VCE(sat)): 300mV; Operating Temperature: -55℃~+150℃; Emitter-Base Voltage(Vebo): 5V
R1 R4 = RE1206F1R000: 电阻类型:采样电阻;阻值:0Ω;精度:±1%;功率:1W;; LCSC Part Name: 0mΩ 1W 1206 ±1%; Supplier Part: C46961765; Manufacturer: 捷而瑞; Supplier Footprint: 1206; JLCPCB Part Class: 扩展库; Datasheet: https://atta.szlcsc.com/upload/public/pdf/source/20250325/401775B85EF7B3A580BC34DFED100CB2.pdf; Supplier: LCSC; Type: 采样电阻; Tolerance: ±1%; Power(Watts): 1W
R2 = 0603WAF4702T5E: 电阻类型:厚膜电阻;阻值:47kΩ;精度:±1%;功率:100mW;工作电压:75V;温度系数:±100ppm/℃;; LCSC Part Name: 47kΩ ±1% 100mW 厚膜电阻; Supplier Part: C25819; Manufacturer: UNI-ROYAL(厚声); Supplier Footprint: 0603; JLCPCB Part Class: 基础库; Datasheet: https://item.szlcsc.com/datasheet/0603WAF4702T5E/26562.html; Supplier: LCSC; Type: 厚膜电阻; Tolerance: ±1%; Power(Watts): 100mW; Voltage-Supply(Max): 75V; Temperature Coefficient: ±100ppm/℃; Operating Temperature: -55℃~+155℃
R3 = 0603WAF2002T5E: 电阻类型:厚膜电阻;阻值:20kΩ;精度:±1%;功率:100mW;最大工作电压:75V;温度系数:±100ppm/℃;; LCSC Part Name: 20kΩ ±1% 100mW 厚膜电阻; Supplier Part: C4184; Manufacturer: UNI-ROYAL(厚声); Supplier Footprint: 0603; JLCPCB Part Class: Basic Part; Datasheet: https://atta.szlcsc.com/upload/public/pdf/source/20200306/C422600_1E6D84923E4A46A82E41ADD87F860B5C.pdf; Supplier: LCSC; Type: 厚膜电阻; Tolerance: ±1%; Power(Watts): 100mW; Overload Voltage (Max): 75V; Temperature Coefficient: ±100ppm/℃; Operating Temperature Range: -55℃~+155℃
R7 = 1206W4F1004T5E: 电阻类型:厚膜电阻;阻值:1MΩ;精度:±1%;功率:250mW;最大工作电压:200V;温度系数:±100ppm/℃;; LCSC Part Name: 1MΩ ±1% 250mW 厚膜电阻; Supplier Part: C17927; Manufacturer: UNI-ROYAL(厚声); Supplier Footprint: 1206; JLCPCB Part Class: 基础库; Datasheet: https://atta.szlcsc.com/upload/public/pdf/source/20200306/C422600_1E6D84923E4A46A82E41ADD87F860B5C.pdf; Supplier: LCSC; Type: 厚膜电阻; Tolerance: ±1%; Power(Watts): 250mW; Overload Voltage (Max): 200V; Temperature Coefficient: ±100ppm/℃; Operating Temperature Range: -55℃~+155℃
R12 = 0603WAF3241T5E: 电阻类型:厚膜电阻;阻值:3.24kΩ;精度:±1%;功率:100mW;工作电压:75V;温度系数:±100ppm/℃;; LCSC Part Name: 3.24kΩ ±1% 100mW 厚膜电阻; Supplier Part: C22994; Manufacturer: UNI-ROYAL(厚声); Supplier Footprint: 0603; JLCPCB Part Class: 扩展库; Datasheet: https://item.szlcsc.com/datasheet/0603WAF3241T5E/23721.html; Supplier: LCSC; Type: 厚膜电阻; Tolerance: ±1%; Power(Watts): 100mW; Voltage-Supply(Max): 75V; Temperature Coefficient: ±100ppm/℃; Operating Temperature: -55℃~+155℃
R13 = 0603WAF3322T5E: 电阻类型:厚膜电阻;阻值:33.2kΩ;精度:±1%;功率:100mW;最大工作电压:75V;温度系数:±100ppm/℃;; LCSC Part Name: 33.2kΩ ±1% 100mW 厚膜电阻; Supplier Part: C23003; Manufacturer: UNI-ROYAL(厚声); Supplier Footprint: 0603; JLCPCB Part Class: 扩展库; Datasheet: https://atta.szlcsc.com/upload/public/pdf/source/20200306/C422600_1E6D84923E4A46A82E41ADD87F860B5C.pdf; Supplier: LCSC; Type: 厚膜电阻; Tolerance: ±1%; Power(Watts): 100mW; Overload Voltage (Max): 75V; Temperature Coefficient: ±100ppm/℃; Operating Temperature Range: -55℃~+155℃
TP1 TP2 = Test-Point: Test Point 测试点
U1 = TPS5430DDAR: 功能类型:降压型;输出类型:可调;工作电压:5.5V~36V;输出电压:1.221V~32.04V;输出电流:3A;; LCSC Part Name: 宽输入范围、3A输出电流的降压转换器; Supplier Part: C9864; Manufacturer: TI(德州仪器); Supplier Footprint: SOIC-8-EP; JLCPCB Part Class: 基础库; Datasheet: https://www.ti.com/cn/lit/gpn/tps5430; Supplier: LCSC; Function: 降压型; Output Type: 可调; Input Voltage: 5.5V~36V; Output Voltage: 1.221V~32.04V; Output Current: 3A; Switching Frequency: 500kHz; Operating Temperature: -40℃~+125℃@(TJ); Synchronous Rectification: 否; Number of Outputs: 1; Topology: 降压式; Switch tube (built-in/external): 内置
U2 = FCH0650-220M: 电感值:22uH;精度:±20%;额定电流:4A;饱和电流(Isat):4.5A;类型:一体成型电感;; LCSC Part Name: 22uH ±20% 4.5A; Supplier Part: C20415539; Manufacturer: FC(方成); Supplier Footprint: SMD,7.5x6.8mm; JLCPCB Part Class: 扩展库; Datasheet: https://atta.szlcsc.com/upload/public/pdf/source/20240103/3C766C904C8879CD7053903CD0724825.pdf; Supplier: LCSC; Tolerance: ±20%; Rated Current: 4A; Saturation Current (Isat): 4.5A; DC Resistance (DCR): 89.5mΩ; Type: 一体成型电感
U3 = LM66200DRLR: LM66200 1.6V 至 5.5V、40mΩ、2.5A、低 IQ、双输入理想二极管; Supplier Part: C3235556; Manufacturer: TI(德州仪器); Supplier Footprint: SOT-583; JLCPCB Part Class: 扩展库; Datasheet: https://www.ti.com/cn/lit/gpn/lm66200; Supplier: LCSC
U4 = TPS562201DDCR: 功能类型:降压型;输出类型:可调;输入电压:4.5V~17V;输出电压:768mV~7V;输出电流:2A;; Supplier Part: C90061; Manufacturer: TI(德州仪器); Supplier Footprint: SOT-6; JLCPCB Part Class: Extended Part; Datasheet: https://www.ti.com/cn/lit/gpn/tps562201; Supplier: LCSC; Function: 降压型; Output Type: 可调; Input Voltage: 4.5V~17V; Output Voltage: 768mV~7V; Output Current: 2A; Switching Frequency: 580kHz; Operating Temperature: -40℃~+125℃@(TJ); Synchronous Rectification: 是; Number of Outputs: 1; Topology: 降压式; Switch tube (built-in/external): 内置; Output Current (Max): 2A

## Nets
24V: DC1.1 F1.1 ; also on sheet 5
GND: BT1.2 C2.2 C3.2 C5.1 C6.1 C8.2 C9.1 C10.1 C13.1 C14.1 C15.1 C16.1 C17.1 C19.1 C20.2 C21.1 C22.1 C23.2 C24.1 C25.1 C26.2 C27.2 C28.2 C29.2 C30.2 C31.2 C32.2 C33.2 C34.2 C35.1 C36.1 C37.2 C38.2 C39.1 C40.2 C41.2 C42.1 C43.1 C44.1 C45.1 C46.1 C47.1 C48.1 C49.1 C50.1 C51.1 C52.2 C53.2 C54.1 C56.1 C57.1 D3.2(A) D4.2(A) H1.4 L1.4 Q3.2(S) R3.1 R4.2 R11.2 R12.1 R15.1 R16.2 R21.1 R23.1 SW2.3 SW2.4 U1.6(GND) U1.9(PowerPAD) U3.1(GND) U3.5(GND) U4.1(GND) U5.4(GND) U5.9(EP) U6.4(VSS) U6.9(EP) U7.14(VSS) U7.22(VSS) U7.37(VSSA) U7.48(VSS) U7.61(VSS) U7.71(VSS) U7.90(VSS) U7.102(VSS) U7.113(VSS) U7.126(VSS) U7.135(VSS) U7.148(VSS) U7.158(VSS) U8.6(VSSQ) U8.12(VSSQ) U8.28(VSS) U8.41(VSS) U8.46(VSSQ) U8.52(VSSQ) U8.54(VSS) Y1.2(GND) Y1.4(GND) ; also on sheet 4 5 6
PGND: C4.2 DC1.4 DC1.5 R7.2 ; also on sheet 4 5
VBUS: U3.6(VIN2) ; also on sheet 5
VCC_3V3: C19.2 C20.1 C26.1 C27.1 C28.1 C29.1 C30.1 C31.1 C32.1 C33.1 C34.1 C35.2 C36.2 C37.1 C39.2 C40.1 C43.2 C44.2 C45.2 C46.2 C47.2 C48.2 C49.2 C50.2 C51.2 C52.1 C53.1 C55.1 D5.1(A) H1.1 L4.1 L5.1 L11.2 R17.2 R18.2 R19.1 R22.2 SW1.3 SW1.4 TP1.1 U5.8(VCC) U7.6(VBAT) U7.15(VDD) U7.23(VDD) U7.36(VDD) U7.49(VDD) U7.62(VDD) U7.72(VDD) U7.82(VDD) U7.91(VDD) U7.103(VDD) U7.114(VDD33USB) U7.127(VDD) U7.136(VDD) U7.149(VDD) U7.159(VDD) U7.172(VDD) U8.1(VDD) U8.3(VDDQ) U8.9(VDDQ) U8.14(VDD) U8.27(VDD) U8.43(VDDQ) U8.49(VDDQ) ; also on sheet 4 5 6
VCC_5V: C13.2 C14.2 C17.2 D6.1(C) R14.2 TP2.1 U3.2(VOUT) U3.7(VOUT) U4.3(VIN) U33.1 ; also on sheet 5 6
VCC_24V: C3.1 C5.2 C6.2 C10.2 Q1.5(D) Q1.6(D) Q1.7(D) Q1.8(D) Q1.9(D) U1.7(VIN)
VDDA: C41.1 C42.2 L5.2 U7.39(VDDA)
BOOT0: C55.2 R23.2 SW1.1 SW1.2 U7.166(BOOT0) ; also on sheet 5
BUZZ: R20.1 U7.86(PH9)
CAN_RX: U7.92(PB12) ; also on sheet 5
CAN_TX: U7.93(PB13) ; also on sheet 5
COUNT: U7.40(PA0-WKUP) ; also on sheet 6
FMC_A0: U7.16(PF0) U8.23(A0)
FMC_A1: U7.17(PF1) U8.24(A1)
FMC_A2: U7.18(PF2) U8.25(A2)
FMC_A3: U7.19(PF3) U8.26(A3)
FMC_A4: U7.20(PF4) U8.29(A4)
FMC_A5: U7.21(PF5) U8.30(A5)
FMC_A6: U7.60(PF12) U8.31(A6)
FMC_A7: U7.63(PF13) U8.32(A7)
FMC_A8: U7.64(PF14) U8.33(A8)
FMC_A9: U7.65(PF15) U8.34(A9)
FMC_A10: U7.66(PG0) U8.22(A10/AP)
FMC_A11: U7.67(PG1) U8.35(A11)
FMC_A12: U7.106(PG2) U8.36(A12)
FMC_BA0: U7.108(PG4) U8.20(BS0)
FMC_BA1: U7.109(PG5) U8.21(BS1)
FMC_CKE: U7.35(PC3_C) U8.37(CKE)
FMC_CLK: U7.112(PG8) U8.38(CLK)
FMC_D0: U7.104(PD14) U8.2(DQ0)
FMC_D1: U7.105(PD15) U8.4(DQ1)
FMC_D2: U7.142(PD0) U8.5(DQ2)
FMC_D3: U7.143(PD1) U8.7(DQ3)
FMC_D4: U7.68(PE7) U8.8(DQ4)
FMC_D5: U7.69(PE8) U8.10(DQ5)
FMC_D6: U7.70(PE9) U8.11(DQ6)
FMC_D7: U7.73(PE10) U8.13(DQ7)
FMC_D8: U7.74(PE11) U8.42(DQ8)
FMC_D9: U7.75(PE12) U8.44(DQ9)
FMC_D10: U7.76(PE13) U8.45(DQ10)
FMC_D11: U7.77(PE14) U8.47(DQ11)
FMC_D12: U7.78(PE15) U8.48(DQ12)
FMC_D13: U7.96(PD8) U8.50(DQ13)
FMC_D14: U7.97(PD9) U8.51(DQ14)
FMC_D15: U7.98(PD10) U8.53(DQ15)
FMC_NBL0: U7.169(PE0) U8.15(LDQM)
FMC_NBL1: U7.170(PE1) U8.39(UDQM)
FMC_NCAS: U7.160(PG15) U8.17(CAS#)
FMC_NCS: R19.2 U7.34(PC2_C) U8.19(CS#)
FMC_NRAS: U7.59(PF11) U8.18(RAS#)
FMC_NWE: U7.53(PA7) U8.16(WE#)
HLK_EN: U7.7(PI8) ; also on sheet 4
HV_EN: U7.44(PH3) ; also on sheet 6
I2C1_SCL: R18.1 U6.6(SCL) U7.164(PB6)
I2C1_SDA: R17.1 U6.5(SDA) U7.165(PB7)
I2C4_SCL: U7.88(PH11) ; also on sheet 5
I2C4_SDA: U7.89(PH12) ; also on sheet 5
KEY_EN: U7.50(PA4) ; also on sheet 5
KEY_LEFT_RIGHT: U7.55(PC5) ; also on sheet 5
KEY_SET: U7.84(PH7) ; also on sheet 5
KEY_UP_DOWN: U7.54(PC4) ; also on sheet 5
LCD_CS: U7.46(PH5) ; also on sheet 5
LCD_PWM: U7.83(PH6) ; also on sheet 5
LCD_RST: U7.45(PH4) ; also on sheet 5
LCD_SCL: U7.132(PI1) ; also on sheet 5
LCD_SDA: U7.33(PC1) ; also on sheet 5
LGND: C4.1 D1.2(A) DC1.2 DC1.3 L1.1 R4.1 R7.1
LORA_AUX: U7.145(PD3) ; also on sheet 5
LORA_M0: U7.147(PD5) ; also on sheet 5
LORA_M1: U7.146(PD4) ; also on sheet 5
LORA_RXD: U7.141(PC12) ; also on sheet 5
LORA_TXD: U7.144(PD2) ; also on sheet 5
LTDC_B0: U7.3(PE4) ; also on sheet 5
LTDC_B1: U7.155(PG12) ; also on sheet 5
LTDC_B2: U7.150(PD6) ; also on sheet 5
LTDC_B3: U7.119(PA8) ; also on sheet 5
LTDC_B4: U7.173(PI4) ; also on sheet 5
LTDC_B5: U7.47(PA3) ; also on sheet 5
LTDC_B6: U7.167(PB8) ; also on sheet 5
LTDC_B7: U7.168(PB9) ; also on sheet 5
LTDC_CLK: U7.111(PG7) ; also on sheet 5
LTDC_DE: U7.28(PF10) ; also on sheet 5
LTDC_G0: U7.4(PE5) ; also on sheet 5
LTDC_G1: U7.5(PE6) ; also on sheet 5
LTDC_G2: U7.52(PA6) ; also on sheet 5
LTDC_G3: U7.118(PC9) ; also on sheet 5
LTDC_G4: U7.130(PH15) ; also on sheet 5
LTDC_G5: U7.131(PI0) ; also on sheet 5
LTDC_G6: U7.13(PI11) ; also on sheet 5
LTDC_G7: U7.133(PI2) ; also on sheet 5
LTDC_HSYNC: U7.12(PI10) ; also on sheet 5
LTDC_R0: U7.43(PH2) ; also on sheet 5
LTDC_R1: U7.42(PA2) ; also on sheet 5
LTDC_R2: U7.41(PA1) ; also on sheet 5
LTDC_R3: U7.56(PB0) ; also on sheet 5
LTDC_R4: U7.51(PA5) ; also on sheet 5
LTDC_R5: U7.32(PC0) ; also on sheet 5
LTDC_R6: U7.57(PB1) ; also on sheet 5
LTDC_R7: U7.110(PG6) ; also on sheet 5
LTDC_VSYNC: U7.11(PI9) ; also on sheet 5
MCU_RST: C56.2 R22.1 SW2.1 SW2.2 U7.31(NRST) ; also on sheet 4 5
MCU_UART1_RX: U7.121(PA10) ; also on sheet 5
MCU_UART1_TX: U7.120(PA9) ; also on sheet 5
MCU_UART3_RX: U7.80(PB11) ; also on sheet 5
MCU_UART3_TX: U7.139(PC10) ; also on sheet 5
OSC_IN: C54.2 U7.29(PH0-OSC_IN) Y1.3(OSC2)
OSC_OUT: C57.2 U7.30(PH1-OSC_OUT) Y1.1(OSC1)
OUT_S1: U7.116(PC7)
OUT_S2: U7.115(PC6)
PM25_RST: U7.87(PH10) ; also on sheet 5
QSPI_BK1_IO0: U5.5(DI(IO0)) U7.26(PF8)
QSPI_BK1_IO1: U5.2(DO(IO1)) U7.27(PF9)
QSPI_BK1_IO2: U5.3(WP#(IO2)) U7.1(PE2)
QSPI_BK1_IO3: U5.7(HOLD#orRESET#(IO3)) U7.24(PF6)
QSPI_BK1_NCS: U5.1(CS#) U7.79(PB10)
QSPI_CLK: U5.6(CLK) U7.58(PB2)
RTC_3V: C24.2 D5.3(K) U6.8(VDD)
STM32_OTG_D+: U7.123(PA12) ; also on sheet 5
STM32_OTG_D-: U7.122(PA11) ; also on sheet 5
SWCLK: H1.3 U7.137(PA14)
SWDIO: H1.2 U7.124(PA13)
SYS_5V: C8.1 C9.2 C11.2 R9.2 R10.1 U2.2 U3.3(VIN1)
VREF+: C38.1 L4.2 U7.38(VREF+)
WLAN_ACT: U7.163(PB5) ; also on sheet 4
WLAN_CS: U7.153(PG10) ; also on sheet 4
WLAN_DUP: U7.162(PB4) ; also on sheet 4
WLAN_LINE: U7.161(PB3) ; also on sheet 4
WLAN_MISO: U7.152(PG9) ; also on sheet 4
WLAN_MOSI: U7.151(PD7) ; also on sheet 4
WLAN_SCLK: U7.154(PG11) ; also on sheet 4
WS2812B_PWM: U7.100(PD12) ; also on sheet 5
$2N1386: D3.1(C) R2.1 R5.1
$2N1394: C1.2 C2.1 D2.2(A) L1.3 Q1.1(S) Q1.2(S) Q1.3(S) Q2.2(E) R1.2 R2.2 R6.2
$2N1529: C1.1 D2.1(K) Q1.4(G) Q2.3(C) R3.2 R6.1
$2N1621: Q2.1(B) R5.2
$2N4256: C7.2 R8.1
$2N4262: C7.1 U1.1(BOOT)
$2N4615: D4.1(K) R8.2 U1.8(PH) U2.1
$2N4746: C11.1 R9.1 R12.2 U1.4(VSENSE)
$2N7879: C12.2 L2.1 U4.2(SW)
$2N7880: C12.1 U4.6(VBST)
$2N7884: C18.1 R13.1 R15.2 U4.4(VFB)
$2N7887: C15.2 C16.2 C18.2 L2.2 L11.1 R13.2
$2N7890: R14.1 U4.5(EN)
$2N8142: R11.1 U3.4(ON#)
$2N8494: R10.2 U3.8(ST)
$2N31144: D1.1(C) F1.2 L1.2 R1.1
$3N2963: BT1.1 D5.2(A)
$3N3430: C21.2 U6.1(OSCI) X1.2
$3N3439: C22.2 U6.2(OSCO) X1.1
$3N9183: C23.1 U7.125(VCAP2)
$3N9229: C25.2 U7.81(VCAP1)
$3N11871: R16.1 U7.171(PDR_ON)
$3N23241: D6.2(A) Q3.3(D) U33.2
$3N23246: Q3.1(G) R20.2 R21.2

Not connected (* = marked no-connect by the designer): U1 2(NC)* 3(NC)* 5(ENA); U6 3(INT#)* 7(CLKOUT)*; U7 2(PE3) 8(PC13) 9(PC14-OSC32_IN)* 10(PC15-OSC32_OUT)* 25(PF7) 85(PH8)* 94(PB14) 95(PB15) 99(PD11) 101(PD13) 107(PG3) 117(PC8) 128(PH13)* 129(PH14)* 134(PI3) 138(PA15) 140(PC11) 156(PG13) 157(PG14) 174(PI5) 175(PI6) 176(PI7); U8 40(NC)*

## Notes on the sheets
sheet 1
- FLASH
- SDRAM
- E32-433T20S
- W25Q64JVZE
- W9825G6KH-6
- 8MB
- 32MB
- 433MHZ
- QSPI
- FMC
- UART5
- FLASH
- RAM
- TX
- RJ45
- PCF85064TP
- W5500
- HLK_7688A
- IIC1
- 2048 kBytes
- 1024 kBytes
- SPI1
- RMII
- RX
- RJ45
- STM32H743
  IIT6
- UART1
- CH340X
- USB_HUB
- Type-C
- 高压可调模块
- I/O
- DP DM
- 盖革管模块电路
- CAN
- TJA1051
- DMR-9S
- UART3
- IIC4
- PWM
- GH1.25 8P
- GH1.25 4P
- FPC 排座
- 炫彩灯
- DMR-9S
- BME280
- D5激光
  PM2.5
  传感器
- AHT20
- 屏幕
  驱动电路
- 按键
- 声光报警模块
- ENS160
sheet 2
- 需修改TVS选型和齐纳二极管参数
- ON#低电平使能，打开通道
  高电平关闭通道
- VIN1通时ST高电平，VIN2通时ST低电平
- 5V转3V3/2A
sheet 3
- IIC地址：1010 001x
